# Altium project ACDC_633_XY.PrjPcb
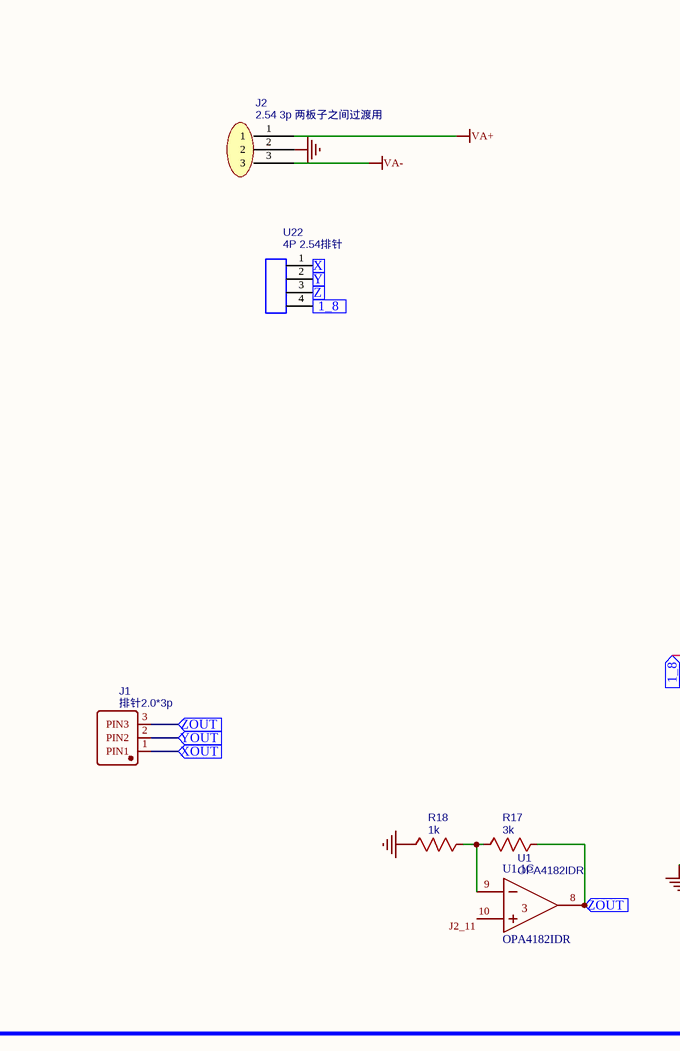
[diagram p0: acdc2.schdoc, middle]
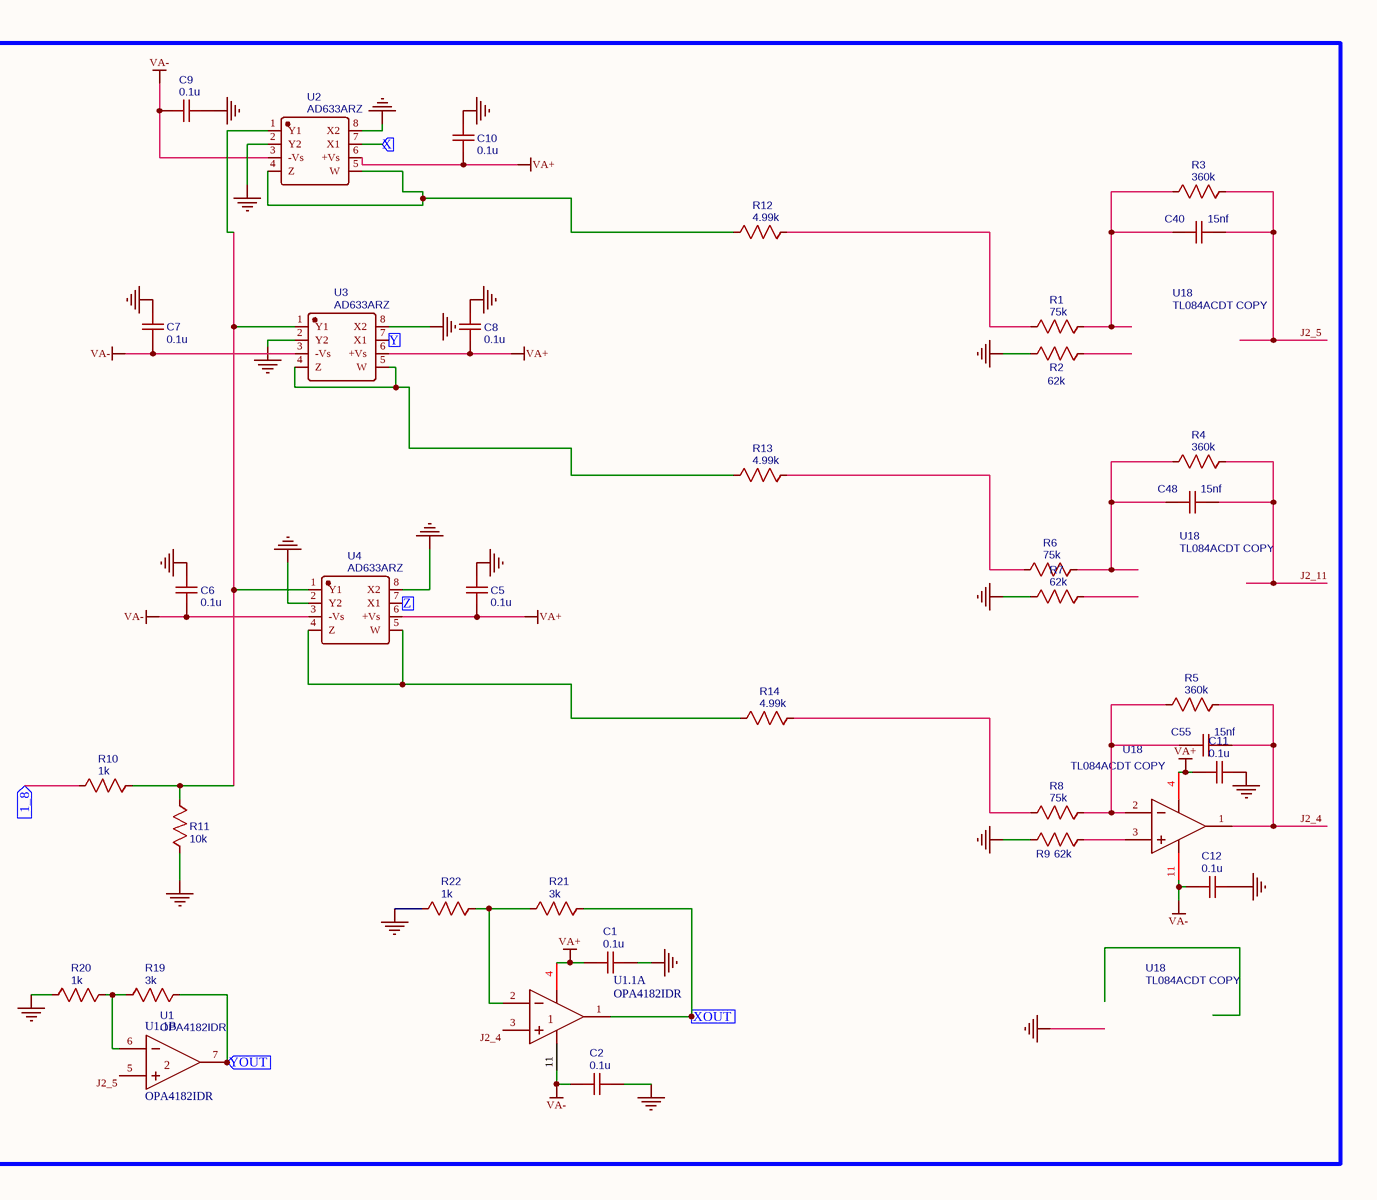
[diagram p1: acdc2.schdoc, right]
1 sheet, 46 parts. Net scope: flat (ports and power ports of the same name join across sheets).
Board file: PCB_ACDC底板 copy copy_2023-12-22.pcbdoc

## Sheet acdc2.schdoc
size 734 x 231 mm; SheetNumber: 1; SheetTotal: 1

### Parts
(Parts that share a designator on the sheet are numbered #1, #2 ... from top to bottom, then left to right.)
C1  0.1u  [C0603]
C2  0.1u  [C0603]
C5  0.1u  [C0603]
C6  0.1u  [C0603]
C7  0.1u  [C0603]
C8  0.1u  [C0603]
C9  0.1u  [C0603]
C10  0.1u  [C0603]
C11  0.1u  [C0603]
C12  0.1u  [C0603]
C40  15nf  [C0805]
C48  15nf  [C0805]
C55  15nf  [C0805]
J1  排针2.0*3p  [排针2.0*3P米有]
J2  2.54 3p 两板子之间过渡用  [XH2.54-3P]
R1  75k  [R0603]
R2  62k  [R0603]
R3  360k  [R0603]
R4  360k  [R0603]
R5  360k  [R0603]
R6  75k  [R0603]
R7  62k  [R0603]
R8  75k  [R0603]
R9  62k  [R0603]
R10  1k  [R0603]
R11  10k  [R0603]
R12  4.99k  [R0603]
R13  4.99k  [R0603]
R14  4.99k  [R0603]
R17  3k  [R0603]
R18  1k  [R0603]
R19  3k  [R0603]
R20  1k  [R0603]
R21  3k  [R0603]
R22  1k  [R0603]
U1#1  OPA4182IDR  [SOIC-14_L8.7-W3.9-P1.27-LS6.0-BL]
U1#2  OPA4182IDR  [SOIC-14_L8.7-W3.9-P1.27-LS6.0-BL]
U1.1  OPA4182IDR  [SOIC-14_L8.7-W3.9-P1.27-LS6.0-BL]  (parts A,B,C of 4)
U2  AD633ARZ  [SOIC-8_L4.9-W3.9-P1.27-LS6.0-BL]
U3  AD633ARZ  [SOIC-8_L4.9-W3.9-P1.27-LS6.0-BL]
U4  AD633ARZ  [SOIC-8_L4.9-W3.9-P1.27-LS6.0-BL]
U18#1  TL084ACDT COPY  [SOP-14_L8.7-W3.9-P1.27-LS6.0-BL]
U18#2  TL084ACDT COPY  [SOP-14_L8.7-W3.9-P1.27-LS6.0-BL]
U18#3  TL084ACDT COPY  [SOP-14_L8.7-W3.9-P1.27-LS6.0-BL]
U18#4  TL084ACDT COPY  [SOP-14_L8.7-W3.9-P1.27-LS6.0-BL]
U22  4P 2.54排针  [2.54-4P]

### Ports
1_8 (in), X (in), XOUT (in), Y (in), YOUT (in), Z (in), ZOUT (in)

### Nets
GND: C1.2 C2.2 C5.2 C6.1 C7.1 C8.2 C9.1 C10.2 C11.1 C12.1 J2.2 R2.1 R7.1 R9.1 R11.1 R18.1 R20.1 R22.1 U2.2(Y2) U2.8(X2) U3.2(Y2) U3.8(X2) U4.2(Y2) U4.8(X2)
VA+: C1.1 C5.1 C8.1 C10.1 C11.2 J2.1 U1.1.4(VCC) U2.6(+Vs) U3.6(+Vs) U4.6(+Vs) U18#3.4(VCC+)
VA-: C2.1 C6.2 C7.2 C9.2 C12.2 J2.3 U1.1.11(GND) U2.3(-Vs) U3.3(-Vs) U4.3(-Vs) U18#3.11(VCC-)
J2_4: C55.2 R5.2 U1.1.3(IN1+) U18#3.1(OUT1)
J2_5: C40.2 R3.2 U1.1.5(IN2+)
J2_11: C48.2 R4.2 U1.1.10(IN3+)
NetC40_1: C40.1 R1.2 R3.1
NetC48_1: C48.1 R4.1 R6.2
NetC55_1: C55.1 R5.1 R8.2 U18#3.2(IN1-)
NetJ1_1: J1.1(PIN1) R21.2 U1.1.1(OUT1) ; port XOUT
NetJ1_2: J1.2(PIN2) R19.2 U1.1.7(OUT2) ; port YOUT
NetJ1_3: J1.3(PIN3) R17.2 U1.1.8(OUT3) ; port ZOUT
NetR1_1: R1.1 R12.2
NetR6_1: R6.1 R13.2
NetR8_1: R8.1 R14.2
NetR9_2: R9.2 U18#3.3(IN1+)
NetR10_1: R10.1 U22.4 ; port 1_8
NetR10_2: R10.2 R11.2 U2.1(Y1) U3.1(Y1) U4.1(Y1)
NetR12_1: R12.1 U2.4(Z) U2.5(W)
NetR13_1: R13.1 U3.4(Z) U3.5(W)
NetR14_1: R14.1 U4.4(Z) U4.5(W)
NetR17_1: R17.1 R18.2 U1.1.9(IN3-)
NetR19_1: R19.1 R20.2 U1.1.6(IN2-)
NetR21_1: R21.1 R22.2 U1.1.2(IN1-)
NetU2_7: U2.7(X1) U22.1 ; port X
NetU3_7: U3.7(X1) U22.2 ; port Y
NetU4_7: U4.7(X1) U22.3 ; port Z

Not connected (* = marked no-connect by the designer): R2 2; R7 2

### Library data of the parts
C1 C2 C5-C12 = 0.1u: nameAlias: Value(F); Contributor: LCEDA_Lib; spicePre: C; spiceSymbolName: C_0603_US
C40 C48 C55 = 15nf: nameAlias: Value(F); Contributor: LCEDA_Lib; spicePre: C; spiceSymbolName: C_0805_US
J1 = 排针2.0*3p: Contributor: akilio; Package Display: No; spicePre: J; spiceSymbolName: 排针2.0*3p
J2 = 2.54 3p 两板子之间过渡用: Contributor: gmy_2022; spicePre: J; spiceSymbolName: 3p
R1 R6 R8 = 75k: nameAlias: Value(Ω); Contributor: LCEDA_Lib; spicePre: R; spiceSymbolName: R_0603_US
R2 R7 R9 = 62k: nameAlias: Value(Ω); Contributor: LCEDA_Lib; spicePre: R; spiceSymbolName: R_0603_US
R3-R5 = 360k: nameAlias: Value(Ω); Contributor: LCEDA_Lib; spicePre: R; spiceSymbolName: R_0603_US
R10 R18 R20 R22 = 1k: nameAlias: Value(Ω); Contributor: LCEDA_Lib; spicePre: R; spiceSymbolName: R_0603_US
R11 = 10k: nameAlias: Value(Ω); Contributor: LCEDA_Lib; spicePre: R; spiceSymbolName: R_0603_US
R12-R14 = 4.99k: nameAlias: Value(Ω); Contributor: LCEDA_Lib; spicePre: R; spiceSymbolName: R_0603_US
R17 R19 R21 = 3k: nameAlias: Value(Ω); Contributor: LCEDA_Lib; spicePre: R; spiceSymbolName: R_0603_US
U1#1 U1#2 = OPA4182IDR: subpart_no: 1; Manufacturer: TI(德州仪器); Supplier: LCSC; Supplier Part: C4371114; Manufacturer Part: OPA4182IDR; link: https://so.szlcsc.com/global.html?k=C4371114&ref=editor; spicePre: U; spiceSymbolName: OPA4182IDR
U1.1 = OPAMP: 运放; Part_number: *; Brand: *
U2-U4 = AD633ARZ: Manufacturer: ADI(亚德诺)/LINEAR(凌特); Contributor: LCSC; Supplier: LCSC; Supplier Part: C431243; Manufacturer Part: AD633ARZ; JLCPCB Part Class: Extended Part; link: https://so.szlcsc.com/global.html?k=C431243&ref=editor; spicePre: U; spiceSymbolName: AD633ARZ
U18#1-U18#4 = TL084ACDT COPY: Manufacturer: ST(意法半导体); subpart_no: 1; Supplier: LCSC; Supplier Part: C2652257; Manufacturer Part: TL084ACDT; spicePre: U; spiceSymbolName: TL084ACDT COPY
U22 = 4P 2.54排针: Contributor: auswi; PCB DECAL: 2.54-4P; spicePre: U; spiceSymbolName: 4P